# EAGLE design hapcan-dali (EAGLE 7.5.0)
PRODUCT_COMPANY: skagmo.com, 2015; PRODUCT_TITLE: HAPCAN compatible DALI gateway, rev. A
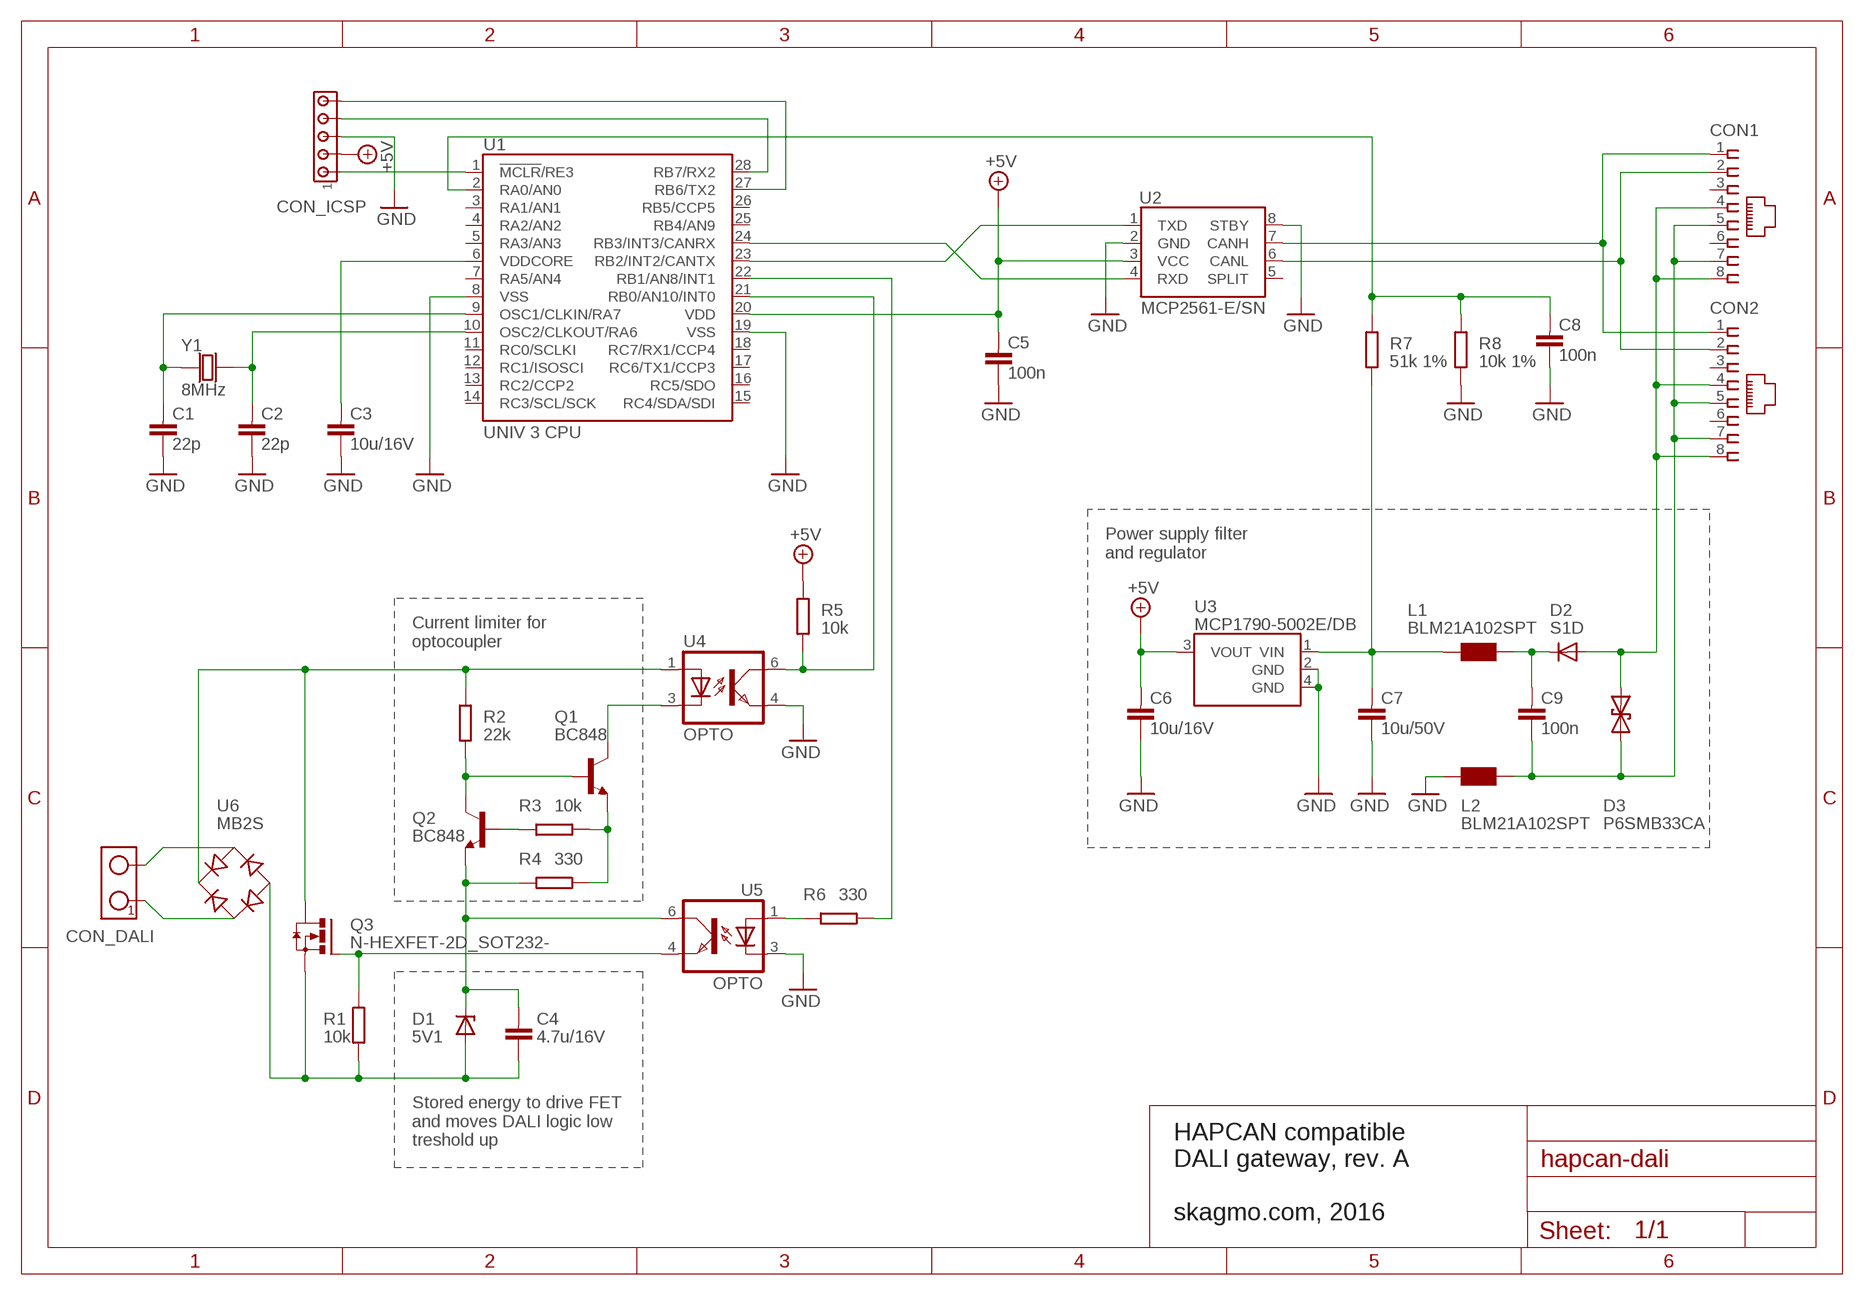
[diagram p0: schematic, sheet 1]

## Parts
C1  22p  CAPACITOR0805  [0805]
C2  22p  CAPACITOR0805  [0805]
C3  10u/16V  CAPACITOR0805  [0805]
C4  4.7u/16V  CAPACITOR0805  [0805]
C5  100n  CAPACITOR0805  [0805]
C6  10u/16V  CAPACITOR0805  [0805]
C7  10u/50V  CAPACITOR1210  [1210]
C8  100n  CAPACITOR0805  [0805]
C9  100n  CAPACITOR0805  [0805]
CON1  RJ45-SOCKET  [RJ45-PCB-SOCKET]
CON2  RJ45-SOCKET  [RJ45-PCB-SOCKET]
CON_DALI  TERMINAL-2  TERMINAL-2-5X10,5MM  [ARK2-5X10,5MM]
CON_ICSP  HEADER5  [SIP-5]
D1  5V1  ZENER-DIODESOT23  [SOT23]
D2  S1D  DIODE_DO-214  [DO-214]
D3  P6SMB33CA  DIODE_TRANSIL2  [DO-214_TRANSIL2]
L1  BLM21A102SPT  CHOKE0805  [0805]
L2  BLM21A102SPT  CHOKE0805  [0805]
Q1  BC848  [SOT23]
Q2  BC848  [SOT23]
Q3  N-HEXFET-2D_SOT232-  [SOT223]
R1  10k  RESISTOR0805  [0805]
R2  22k  RESISTOR0805  [0805]
R3  10k  RESISTOR0805  [0805]
R4  330  RESISTOR0805  [0805]
R5  10k  RESISTOR0805  [0805]
R6  330  RESISTOR0805  [0805]
R7  51k 1%  RESISTOR0805  [0805]
R8  10k 1%  RESISTOR0805  [0805]
U1  UNIV 3 CPU  UNIV3CPU  [UNIV3CPU]
U2  MCP2561-E/SN  [SO-08]
U3  MCP1790-5002E/DB  MCP1790  [SOT-223]
U4  OPTO  [TLP185]
U5  OPTO  [TLP185]
U6  MB2S  [SOIC-4]
Y1  8MHz  CRYSTAL-HC49V  [CRYSTAL-HC49V]

## Nets
+5V: C5.1 C6.1 CON_ICSP.2 R5.1 U1.20(VDD) U2.3(VCC) U3.3(VOUT)
CAN_N: CON1.2 CON2.2 U2.6(CANL)
CAN_P: CON1.1 CON2.1 U2.7(CANH)
GND: C1.2 C2.2 C3.2 C5.2 C6.2 C7.2 C8.2 CON_ICSP.3 L2.1 R8.1 U1.8(VSS) U1.19(VSS) U2.2(GND) U2.8(STBY) U3.2(GND) U3.4(GND) U4.4(EMIT) U5.3(C)
N$1: Q1.2(E) R3.1 R4.2
N$2: U1.24(RB3/INT3/CANRX) U2.4(RXD)
N$3: U1.23(RB2/INT2/CANTX) U2.1(TXD)
N$4: Q2.1(B) R3.2
N$5: C9.1 D2.C L1.2
N$6: Q1.1(B) Q2.3(C) R2.1
N$7: C4.2 D1.1(A) Q3.3(S) R1.1 U6.-
N$8: CON_ICSP.1 U1.1(!MCLR!/RE3)
N$9: CON1.4 CON1.8 CON2.4 CON2.8 D2.A D3.C
N$10: CON_ICSP.4 U1.28(RB7/RX2)
N$11: Q1.3(C) U4.3(C)
N$14: CON_ICSP.5 U1.27(RB6/TX2)
N$15: C2.1 U1.10(OSC2/CLKOUT/RA6) Y1.2
N$16: C8.1 R7.2 R8.2 U1.2(RA0/AN0)
N$17: C7.1 L1.1 R7.1 U3.1(VIN)
N$19: CON_DALI.1 U6.~1(AC1)
N$20: CON_DALI.2 U6.~2(AC2)
N$21: R6.1 U1.22(RB1/AN8/INT1)
N$22: C9.2 CON1.5 CON1.7 CON2.5 CON2.7 D3.A L2.2
N$23: Q3.1(G) R1.2 U5.4(EMIT)
N$24: Q3.2(D) Q3.4(D) R2.2 U4.1(A) U6.+
N$26: R5.2 U1.21(RB0/AN10/INT0) U4.6(COL)
N$28: C4.1 D1.3(C) Q2.2(E) R4.1 U5.6(COL)
N$30: R6.2 U5.1(A)
N$40: C1.1 U1.9(OSC1/CLKIN/RA7) Y1.1
N$56: C3.1 U1.6(VDDCORE)
Unconnected: CON1.3 CON1.6 CON2.3 CON2.6 U1.3(RA1/AN1) U1.4(RA2/AN2) U1.5(RA3/AN3) U1.7(RA5/AN4) U1.11(RC0/SCLKI) U1.12(RC1/ISOSCI) U1.13(RC2/CCP2) U1.14(RC3/SCL/SCK) U1.15(RC4/SDA/SDI) U1.16(RC5/SDO) U1.17(RC6/TX1/CCP3) U1.18(RC7/RX1/CCP4) U1.25(RB4/AN9) U1.26(RB5/CCP5) U2.5(SPLIT)

## Notes on the sheet
- Power supply filter
  and regulator
- Current limiter for
  optocoupler
- Stored energy to drive FET
  and moves DALI logic low 
  treshold up
- HAPCAN compatible
  DALI gateway, rev. A
  
  skagmo.com, 2016

## Library data of the parts
C1-C9 = HAPCAN_devices - UNIV3:CAPACITOR: HAPCAN Capacitor
CON1 CON2 = HAPCAN_devices - UNIV3:RJ45-SOCKET: HAPCAN RJ45 socket
CON_DALI = HAPCAN_devices - UNIV3:TERMINAL-2: HAPCAN Terminal Block - 2 way
CON_ICSP = HAPCAN_devices - UNIV3:HEADER5: HAPCAN Header 5
D1 = diode:ZENER-DIODE: Z-Diode
D2 = HAPCAN_devices - UNIV3:DIODE: HAPCAN Rectifier Diode
D3 = HAPCAN_devices - UNIV3-eagle5:DIODE_TRANSIL2: HAPCAN Bidirectional transil diode
L1 L2 = HAPCAN_devices - UNIV3:CHOKE: Choke
Q1 Q2 = transistor-neu-to92:BC848: NPN TRANSISTOR
Q3 = transistor-power:N-HEXFET-2D_?-*: HEXFET® Power MOSFET 2 Drain connects http://www.irf.com/product-info/datasheets/data/irll014n.pdf
R1-R8 = HAPCAN_devices - UNIV3:RESISTOR: HAPCAN Resistor
U1 = HAPCAN_devices - UNIV3-eagle5:UNIV3CPU: HAPCAN Microcontroller UNIV 3 CPU
U2 = HAPCAN_devices - UNIV3:MCP2561: HAPCAN CAN Tranceiver
U3 = HAPCAN_devices - UNIV3:MCP1790: 70 mA, High Voltage Regulator
U4 U5 = 01-eos-components:OPTO
U6 = rectifier:MB*S: Bridge Rectifier Source: http://www.fairchildsemi.com/ds/MB/MB6S.pdf
Y1 = HAPCAN_devices - UNIV3:CRYSTAL: HAPCAN Crystal

## Board
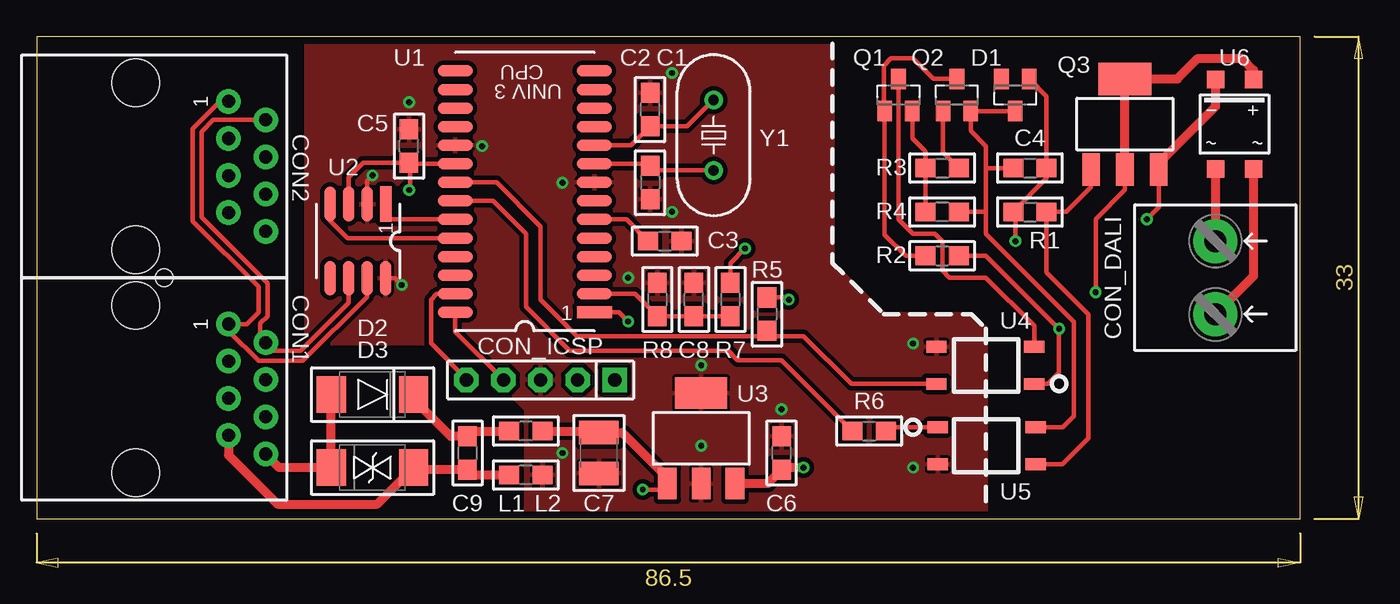
[diagram p1: board, top side]
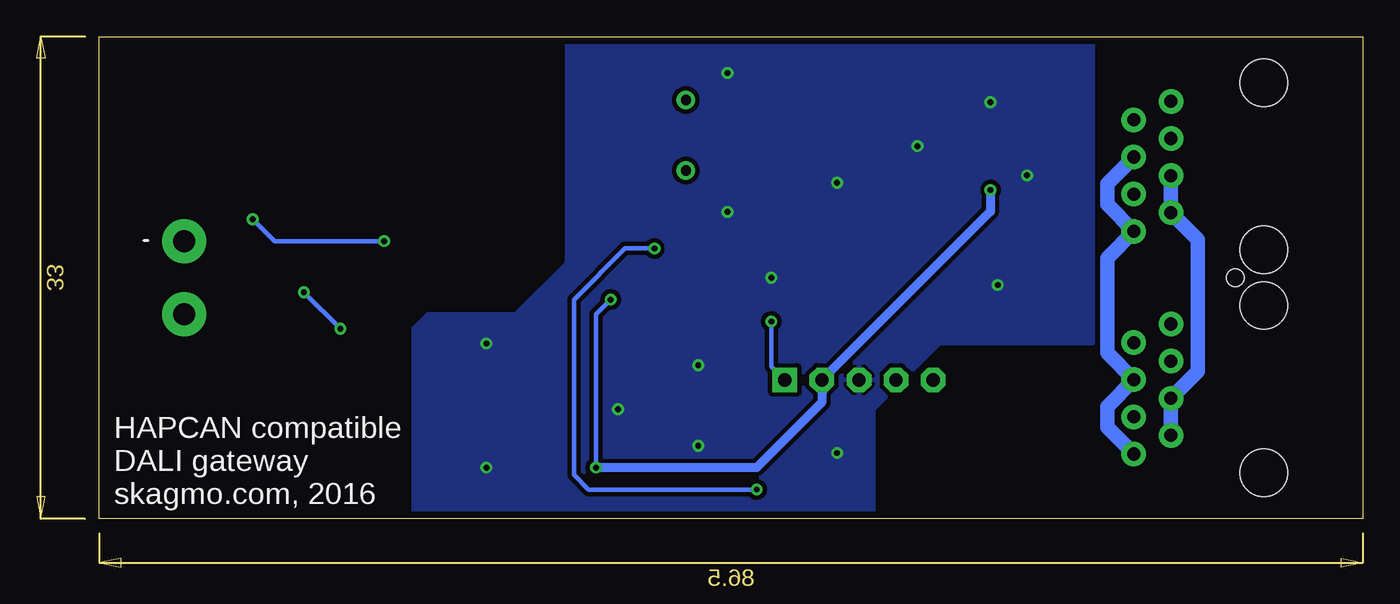
[diagram p2: board, bottom side, seen from below]

Size 86.5 x 33 mm. Coordinates in mm from the lower left corner, seen from the top.
Outline: 0,33 0,0 86.5,0 86.5,33 0,33
Copper layers (1+2*15+16): Top 0.035mm / dielectric 0.2mm / Route2 0.035mm / dielectric 1mm / Route15 0.035mm / dielectric 0.2mm / Bottom 0.035mm
Design rules "mr_drc *": minimum track width 0.15mm, minimum drill 0.3mm, track to track 0.15mm, track to pad 0.15mm, pad to pad 0.15mm, via to via 0.15mm, smd to smd 0.05mm, copper to edge 0.5mm, drill to drill 0.5mm, minimum pad ring 0.2mm, minimum via ring 0.2mm, stop-mask expansion 0.05mm, vias tented up to drill 0.8mm, thermal gap 0.2mm
Holes 1.2 mm at 8.74,16.5
tKeepout: 4 lines

### Footprints (pad centres in the part's own frame; a part is rotated, then mirrored left to right if it is on the bottom)
0805 = smd 1.372 x 1.27: 1 -1.143,0; 2 1.143,0
1210 = smd 1.6 x 2.7: 1 -1.4,0; 2 1.4,0
RJ45-PCB-SOCKET = drill 0.9 pad 1.676: 1 -4.445,6.35; 2 -3.175,8.89; 3 -1.905,6.35; 4 -0.635,8.89; 5 0.635,6.35; 6 1.905,8.89; 7 3.175,6.35; 8 4.445,8.89 | hole 3.251: -5.715,0; 5.715,0
ARK2-5X10,5MM = drill 1.5 pad 3: 1 -2.5,0; 2 2.5,0
SIP-5 = drill 0.9 pad 1.676 square: 1 -5.08,0 | drill 0.9 pad 1.676 octagon: 2 -2.54,0; 3 0,0; 4 2.54,0; 5 5.08,0
SOT23 = smd 1 x 1.4: 1 -0.95,-1.1; 2 0.95,-1.1; 3 0,1.1
DO-214 = smd 2 x 2.5: A 2.82,0; C -2.82,0
DO-214_TRANSIL2 = smd 2 x 2.5: A 2.82,0; C -2.82,0
SOT223 = smd 1.219 x 2.235: 1 -2.311,-3.099; 2 0,-3.099; 3 2.311,-3.099 | smd 3.6 x 2.2: 4 0,3.099
UNIV3CPU = smd 2.4 x 0.8: 1 -4.763,8.255; 2 -4.763,6.985; 3 -4.763,5.715; 4 -4.763,4.445; 5 -4.763,3.175; 6 -4.763,1.905; 7 -4.763,0.635; 8 -4.763,-0.635; 9 -4.763,-1.905; 10 -4.763,-3.175; 11 -4.763,-4.445; 12 -4.763,-5.715; 13 -4.763,-6.985; 14 -4.763,-8.255; 15 4.763,-8.255; 16 4.763,-6.985; 17 4.763,-5.715; 18 4.763,-4.445; 19 4.763,-3.175; 20 4.763,-1.905; 21 4.763,-0.635; 22 4.763,0.635; 23 4.763,1.905; 24 4.763,3.175; 25 4.763,4.445; 26 4.763,5.715; 27 4.763,6.985; 28 4.763,8.255
SO-08 = smd 2.4 x 0.8: 1 -2.54,1.905; 2 -2.54,0.635; 3 -2.54,-0.635; 4 -2.54,-1.905; 5 2.54,-1.905; 6 2.54,-0.635; 7 2.54,0.635; 8 2.54,1.905
SOT-223 = smd 1.27 x 2.159: 1 -2.311,-3.099; 2 0,-3.099; 3 2.311,-3.099 | smd 3.556 x 2.159: 4 0,3.099
TLP185 = smd 0.8 x 1.4: 1 -1.27,-3.3; 3 1.27,-3.3; 4 1.27,3.4; 6 -1.27,3.4
SOIC-4 = smd 1.2 x 1.2: + 1.3,3.05; - -1.3,3.05; ~1 -1.3,-3.05; ~2 1.3,-3.05
CRYSTAL-HC49V = drill 0.7 pad 1.27: 1 -2.413,0; 2 2.413,0

### Placement (x,y rotation side)
C1  42,23 270 top
C2  42,28 90 top
C3  43,19 0 top
C4  68,24 0 top
C5  25.5,25.5 90 top
C6  51,4.5 90 top
C7  38.5,4.5 270 top
C8  45,15 90 top
C9  29.5,4.5 270 top
CON1  6.8,8.88 270 top
CON2  6.8,24.12 270 top
CON_DALI  80.7,16.5 270 top
CON_ICSP  34.5,9.5 180 top
D1  67,29 180 top
D2  23,8.5 180 top
D3  23,3.5 0 top
L1  33.5,6 180 top
L2  33.5,3 180 top
Q1  59,29 0 top
Q2  63,29 0 top
Q3  74.5,27 0 top
R1  68,21 0 top
R2  62,18 0 top
R3  62,24 0 top
R4  62,21 180 top
R5  50,14 270 top
R6  57,6 0 top
R7  47.5,15 270 top
R8  42.5,15 270 top
U1  33.42,22.39 180 top
U2  22,19 270 top
U3  45.5,5.5 0 top
U4  65,10.5 90 top
U5  65,5 270 top
U6  82,27 0 top
Y1  46.35,26.25 90 top

### Tracks (layer width: path | path; a pad name or v marks a point on that pad's centre or on a via)
+5V  (via drill 0.4)
  Top 0.3: U1.20 25.57,24.29 | 25.57,24.29 C5.1 22.36,24.36 21.36,23.36 U2.3 | 25.57,24.29 25.57,22.43 v25.5,22.5 | R5.1 51.36,15.14 v51.5,15
  Top 0.6: v52.5,3.5 51.05,3.5 C6.1 50.04,2.4 U3.3
  Bottom 0.3: v52.5,3.5 52.5,14 v51.5,15
  Bottom 0.6: v25.5,22.5 25.5,21.04 CON_ICSP.2 37.04,7.96 41.5,3.5 v52.5,3.5
CAN_N
  Top 0.3: 15.3,13.13 15.3,12.44 CON1.2
  Top 0.305: U2.6 21.36,14.8 18.07,11.5 16.25,11.5 CON1.2 | CON2.2 12.1,27.3 11.3,26.5 11.3,20.63 15.8,16.13 15.8,13.87 15.3,13.37 15.3,13.13
CAN_P
  Top 0.305: U2.7 22.64,15.2 18.23,10.8 15.2,10.8 13.15,12.85 CON1.1 14.39,13.32 15.2,14.13 15.2,15.87 10.7,20.37 10.7,26.7 12.56,28.57 CON2.1
GND  (via drill 0.4)
  Top 0.3: U2.2 22.64,23.14 v23,23.5 | U2.8 24.54,16.46 v25,16
  other vias: 25.5,28.5 43.5,21 43.5,30.5 40.5,16.5 30.5,25.5 36,23 36,4.5 45.5,10.5 45.5,5 60,3.5 60,12 51,7.5
  pour Top (isolate 0.305): 65,-0.5 33.5,-0.5 33.5,7.5 29,12 18.5,12 18.5,33.5 54.5,33.5 54.5,17.5 58,14 64,14 65,13
  pour Bottom (isolate 0.305): 65,-0.5 33.5,-0.5 33.5,7.5 29,12 18.5,12 18.5,33.5 54.5,33.5 54.5,17.5 58,14 64,14 65,13
N$1
  Top 0.305: R4.2 R3.1 60.86,25.14 59.95,26.05 Q1.2
N$2
  Top 0.3: U1.24 21.29,19.21 20.75,19.75
  Top 0.305: 21,19.5 20.75,19.75 20.09,20.41 U2.4
N$3
  Top 0.3: U1.23 24.02,20.48 24,20.5 24,21.45 U2.1
N$4
  Top 0.305: Q2.1 62.05,25.09 R3.2
N$5
  Top 0.6: L1.2 29.86,6 C9.1 28.36,5.64 25.5,8.5 D2.C
N$6
  Top 0.305: R2.1 59.5,18 58.05,19.45 Q1.1 58,28.45 58,31 58.5,31.5 60,31.5 61.4,30.1 Q2.3
N$7  (via drill 0.4)
  Top 0.3: D1.1 69.14,28.91 C4.2 69.14,23.29 R1.1 67,20.86 v67,19 | v76,20.5 76.81,21.31 Q3.3
  Top 0.6: Q3.3 77,24.5 80.7,28.2 U6.-
  Bottom 0.3: v67,19 74.5,19 v76,20.5
N$8  (via drill 0.4)
  Top 0.3: U1.1 39.87,14.13 v40.5,13.5
  Bottom 0.3: v40.5,13.5 40.5,10.42 CON_ICSP.1
N$9
  Top 0.6: D2.A D3.C 16.62,3.5 CON1.8
  Bottom 1: CON2.4 17.5,22.92 17.5,21.51 CON2.8 17.5,17.84 17.5,11.35 CON1.4 17.5,7.68 17.5,6.27 CON1.8
N$10
  Top 0.3: CON_ICSP.4 28.66,12.8 U1.28
N$11
  Top 0.305: Q1.3 59,20.5 60,19.5 61.5,19.5 62,19 62,17 62.5,16.5 65,16.5 68.3,13.2 U4.3
N$14
  Top 0.3: U1.27 27.4,15.4 27,15 27,12 29.42,9.58 CON_ICSP.5
N$15
  Top 0.3: U1.10 40.7,25.56 C2.1 44.54,26.86 Y1.2
N$16
  Top 0.3: R7.2 C8.1 R8.2 40.95,15.4 U1.2
N$17  (via drill 0.4)
  Top 0.3: 38.4,6 C7.1 | R7.1 47.5,17.5 v48.5,18.5 | v41.5,2 42.79,2 U3.1
  Top 0.6: L1.1 38.4,6 | C7.1 40.1,5.9 43.19,2.81 U3.1
  Bottom 0.3: v48.5,18.5 50.5,18.5 54,15 54,3 53,2 v41.5,2
N$19
  Top 0.6: U6.~1 CON_DALI.1
N$20
  Top 0.6: U6.~2 83.3,16.6 CON_DALI.2
N$21
  Top 0.3: U1.22 31.25,21.75 33.5,19.5 33.5,14.5 36.5,11.5 47.36,11.5 48,10.86 51,10.86 R6.1
N$22
  Top 0.6: CON1.7 13.15,4.35 16.5,1 23.32,1 D3.A 26.46,3.36 C9.2 29.86,3 L2.2
  Bottom 1: CON2.5 CON2.7 11.3,19.1 11.3,10.09 CON1.5 CON1.7
N$23
  Top 0.3: U5.4 70.23,3.73 72,5.5 72,14 69.14,16.86 R1.2 70.5,21 72.19,22.69 Q3.1
N$24  (via drill 0.4)
  Top 0.3: U4.1 69.23,9.23 70,10 v70,13 65,18 R2.2 | v72.5,15.5 72.5,20.5 74.5,22.5 Q3.2
  Top 0.6: U6.+ 83.3,30.7 82.5,31.5 79.5,31.5 78.1,30.1 Q3.4 Q3.2
  Bottom 0.3: v70,13 v72.5,15.5
N$26
  Top 0.3: U1.21 31.48,23.02 34.5,20 34.5,15 37,12.5 50,12.5 | 50,12.5 52.5,12.5 55.77,9.23 U4.6 | R5.2 49.64,12.86 50,12.5
N$28
  Top 0.3: 63.45,21.31 R4.1 65,21 65,19.5 71,13.5 71,7 70.27,6.27 U5.6 | C4.1 65,24
  Top 0.305: 65,21 65,24 65,25.5 63.95,26.55 Q2.2 D1.3
N$30
  Top 0.3: U5.1 58.37,6.27 R6.2
N$40
  Top 0.3: U1.9 41.85,24.29 C1.1
  Top 0.305: Y1.1 42.24,23.84 C1.1
N$56
  Top 0.3: U1.6 40.38,20.48 C3.1

### Text on the board
bPlace: HAPCAN compatible / DALI gateway / skagmo.com, 2016